# EAGLE design getinline_rev0_unpanaled (EAGLE 7.5.0)
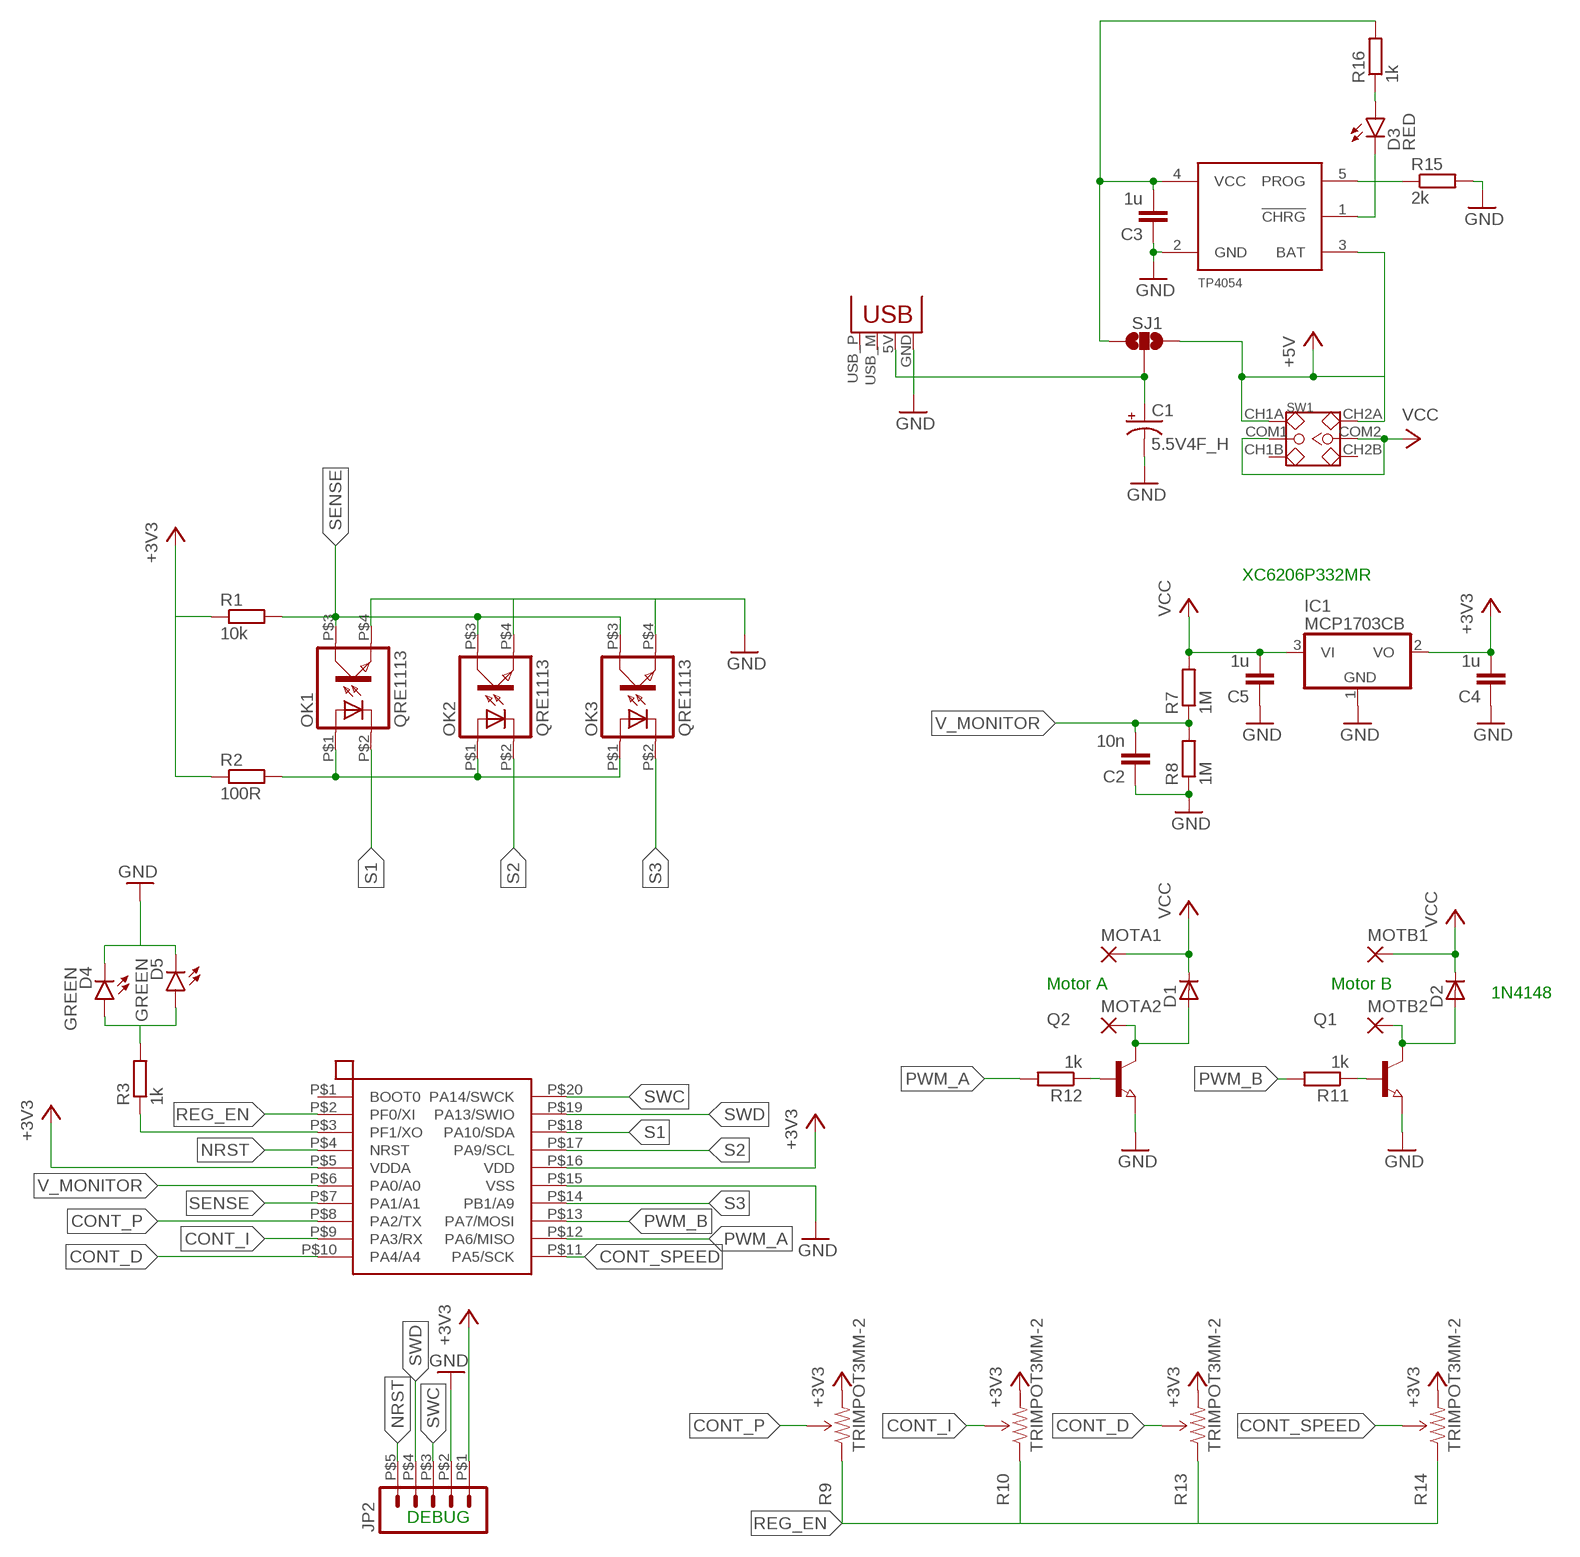
[diagram p0: schematic, sheet 1]

## Parts
C1  5.5V4F_H  [5.5V4F_H]
C2  10n  C-EUC0805  [C0805]
C3  1u  C-EUC0805  [C0805]
C4  1u  C-EUC0805  [C0805]
C5  1u  C-EUC0805  [C0805]
D1  D-SOD-80  [SOD80]
D2  D-SOD-80  [SOD80]
D3  RED  LED-RED1206  [LED-1206]
D4  GREEN  LED-GREENLARGE  [LED-1206]
D5  GREEN  LED-GREENLARGE  [LED-1206]
IC1  MCP1703CB  [SOT23]
JP1  USBPCB  [USB-A-PCB]
JP2  M05  [SMD_HEADER_5P]
MCU  STM32F030F4P6  [TSSOP-20]
MOTA1  1,6/0,9  [1,6/0,9]
MOTA2  1,6/0,9  [1,6/0,9]
MOTB1  1,6/0,9  [1,6/0,9]
MOTB2  1,6/0,9  [1,6/0,9]
OK1  QRE1113  [DIL04]
OK2  QRE1113  [DIL04]
OK3  QRE1113  [DIL04]
Q1  NPN-TRANSISTOR_SOT23  [SOT23]
Q2  NPN-TRANSISTOR_SOT23  [SOT23]
R1  10k  R-EU_R0805  [R0805]
R2  100R  R-EU_R0805  [R0805]
R3  1k  R-EU_R0805  [R0805]
R7  1M  R-EU_R0805  [R0805]
R8  1M  R-EU_R0805  [R0805]
R9  TRIMPOT3MM-2  [TRIMPOT-3MM-2]
R10  TRIMPOT3MM-2  [TRIMPOT-3MM-2]
R11  1k  R-EU_R0805  [R0805]
R12  1k  R-EU_R0805  [R0805]
R13  TRIMPOT3MM-2  [TRIMPOT-3MM-2]
R14  TRIMPOT3MM-2  [TRIMPOT-3MM-2]
R15  2k  R-EU_R0805  [R0805]
R16  1k  R-EU_R0805  [R0805]
SJ1  JUMPER-PAD-3-NOFULL_BOX_SILK  [PAD-JUMPER-3-NO_YES_SILK_FULL_BOX]
SW1  DIP-TOGGLE-SWITCH-2CH-(2X3P-2.54)  [SW6-2.54-9.0X3.5X3.2+2.0MM]
U$1  TP4054_LIPO_CHARGER  [SOT23-5]

## Nets
+3V3: C4.2 IC1.2(VO) JP2.P$1 MCU.P$5(VDDA) MCU.P$16(VDD) R1.1 R2.1 R9.3(CW) R10.3(CW) R13.3(CW) R14.3(CW)
+5V: SJ1.3 SW1.CH1A SW1.CH2A U$1.3(BAT)
CONT_D: MCU.P$10(PA4/A4) R13.2(WIPER)
CONT_I: MCU.P$9(PA3/RX) R10.2(WIPER)
CONT_P: MCU.P$8(PA2/TX) R9.2(WIPER)
CONT_SPEED: MCU.P$11(PA5/SCK) R14.2(WIPER)
GND: C1.P$2(-) C2.1 C3.1 C4.1 C5.1 D4.C D5.C IC1.1(GND) JP1.GND JP2.P$2 MCU.P$15(VSS) OK1.P$4(EMIT) OK2.P$4(EMIT) OK3.P$4(EMIT) Q1.2(E) Q2.2(E) R8.1 R15.2 U$1.2(GND)
LED: MCU.P$3(PF1/XO) R3.1
LEDOUT: D4.A D5.A R3.2
N$1: OK1.P$1(A) OK2.P$1(A) OK3.P$1(A) R2.2
N$3: C3.2 R16.2 SJ1.1 U$1.4(VCC)
N$4: C1.P$1(+) JP1.5V(VBUS) SJ1.2
N$5: R15.1 U$1.5(PROG)
N$6: D3.C U$1.1(!CHRG)
N$7: D3.A R16.1
N$9: Q1.1(B) R11.1
N$10: Q2.1(B) R12.1
N$13: D1.2(A) MOTA2.1(P) Q2.3(C)
N$14: D2.2(A) MOTB2.1(P) Q1.3(C)
NRST: JP2.P$5 MCU.P$4(NRST)
PWM_A: MCU.P$12(PA6/MISO) R12.2
PWM_B: MCU.P$13(PA7/MOSI) R11.2
REG_EN: MCU.P$2(PF0/XI) R9.1(CCW) R10.1(CCW) R13.1(CCW) R14.1(CCW)
S1: MCU.P$18(PA10/SDA) OK1.P$2(C)
S2: MCU.P$17(PA9/SCL) OK2.P$2(C)
S3: MCU.P$14(PB1/A9) OK3.P$2(C)
SENSE: MCU.P$7(PA1/A1) OK1.P$3(COL) OK2.P$3(COL) OK3.P$3(COL) R1.2
SWC: JP2.P$3 MCU.P$20(PA14/SWCK)
SWD: JP2.P$4 MCU.P$19(PA13/SWIO)
V_MONITOR: C2.2 MCU.P$6(PA0/A0) R7.1 R8.2
VCC: C5.2 D1.1(C) D2.1(C) IC1.3(VI) MOTA1.1(P) MOTB1.1(P) R7.2 SW1.COM1 SW1.COM2
Unconnected: JP1.USB_M(D-) JP1.USB_P(D+) MCU.P$1(BOOT0) SW1.CH1B SW1.CH2B

## Notes on the sheet
- XC6206P332MR
- Motor A | Motor B
- 1N4148
- DEBUG

## Library data of the parts
C1 = supercaps:5.5V4F_H
C2-C5 = resistor:C-EU: CAPACITOR, European symbol
D1 D2 = semicon-smd-ipc:D-: DIODE unfilled
D3 = SparkFun-LED:LED-RED: Assorted Red LEDs LilyPad 1206- DIO-09912 1206- DIO-00809 0603- DIO-00819; PROD_ID: DIO-00809
D4 D5 = SparkFun-LED:LED-GREEN: Various green LEDs Green LEDs used in SFE Production 0603- DIO-00821 LARGE- DIO-00862 LILYPAD- DIO-09910; PROD_ID: DIO-00862
IC1 = linear:MCP1703: 250 mA, 16V, Low Quiescent Current LDO Regulator Source: http://ww1.microchip.com/downloads/en/DeviceDoc/22049b.pdf
JP1 = SparkFun-Connectors:USB: USB Connectors USB-B-PTH is fully proven SKU : PRT-00139/CONN-08278 USB-miniB is fully proven SKU : PRT-00587 USB-A-PCB is untested. USB-A-H is throughly reviewed, but untested. Spark Fun Electronics SKU : PRT-00437 USB-B-SMT is throughly reviewed, but untested. Needs silkscreen touching up. USB-A-S has not been used/tested USB-MB-H has not been used/tested USB-MICROB has been used. CONN-09505
JP2 = smd_pinheader:M05: Header 5 Standard 5-pin 0.1" header. Use with straight break away headers (SKU : PRT-00116), right angle break away headers (PRT-00553), swiss pins (PRT-00743), machine pins (PRT-00117), and female headers (PRT-00115). Molex polarized connector foot print use with SKU : PRT-08230 with associated crimp pins and housings.
MCU = pulseoxparts:STM32F030F4P6
MOTA1 MOTA2 MOTB1 MOTB2 = wirepad:1,6/0,9: THROUGH-HOLE PAD
OK1-OK3 = fairchild_optosensor:QRE1113: FAIRCHILD REFLECTIVE SENSOR
Q1 Q2 = semicon-smd-ipc:NPN-TRANSISTOR_: NPN TRANSISTOR
R1-R3 R7 R8 R11 R12 R15 R16 = resistor:R-EU_: RESISTOR, European symbol
R9 R10 R13 R14 = SparkFun-Electromechanical:TRIMPOT: Various small potentiometers for "set-and-forget" applications
SJ1 = SparkFun-Passives:JUMPER-PAD-3-NO
SW1 = Seeed-Switch-2016:DIP-TOGGLE-SWITCH-2CH-(2X3P-2.54): 311010004; MPN: MS-22D18 G2 ROHS
U$1 = TP4054_lipocharger:TP4054_LIPO_CHARGER

## Board
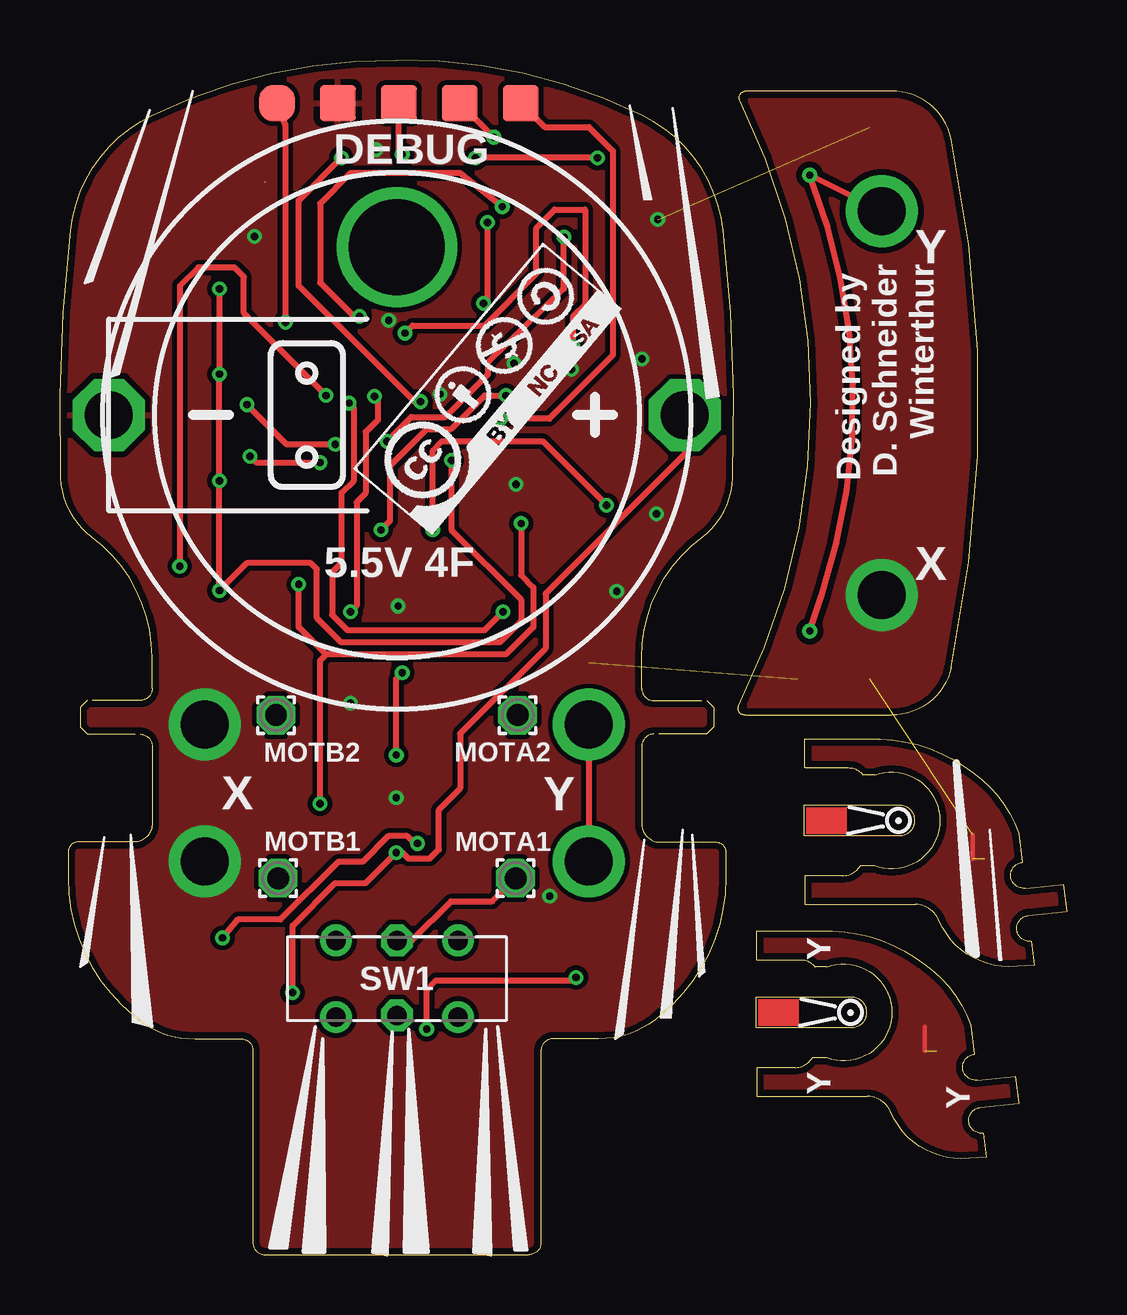
[diagram p1: board, top side]
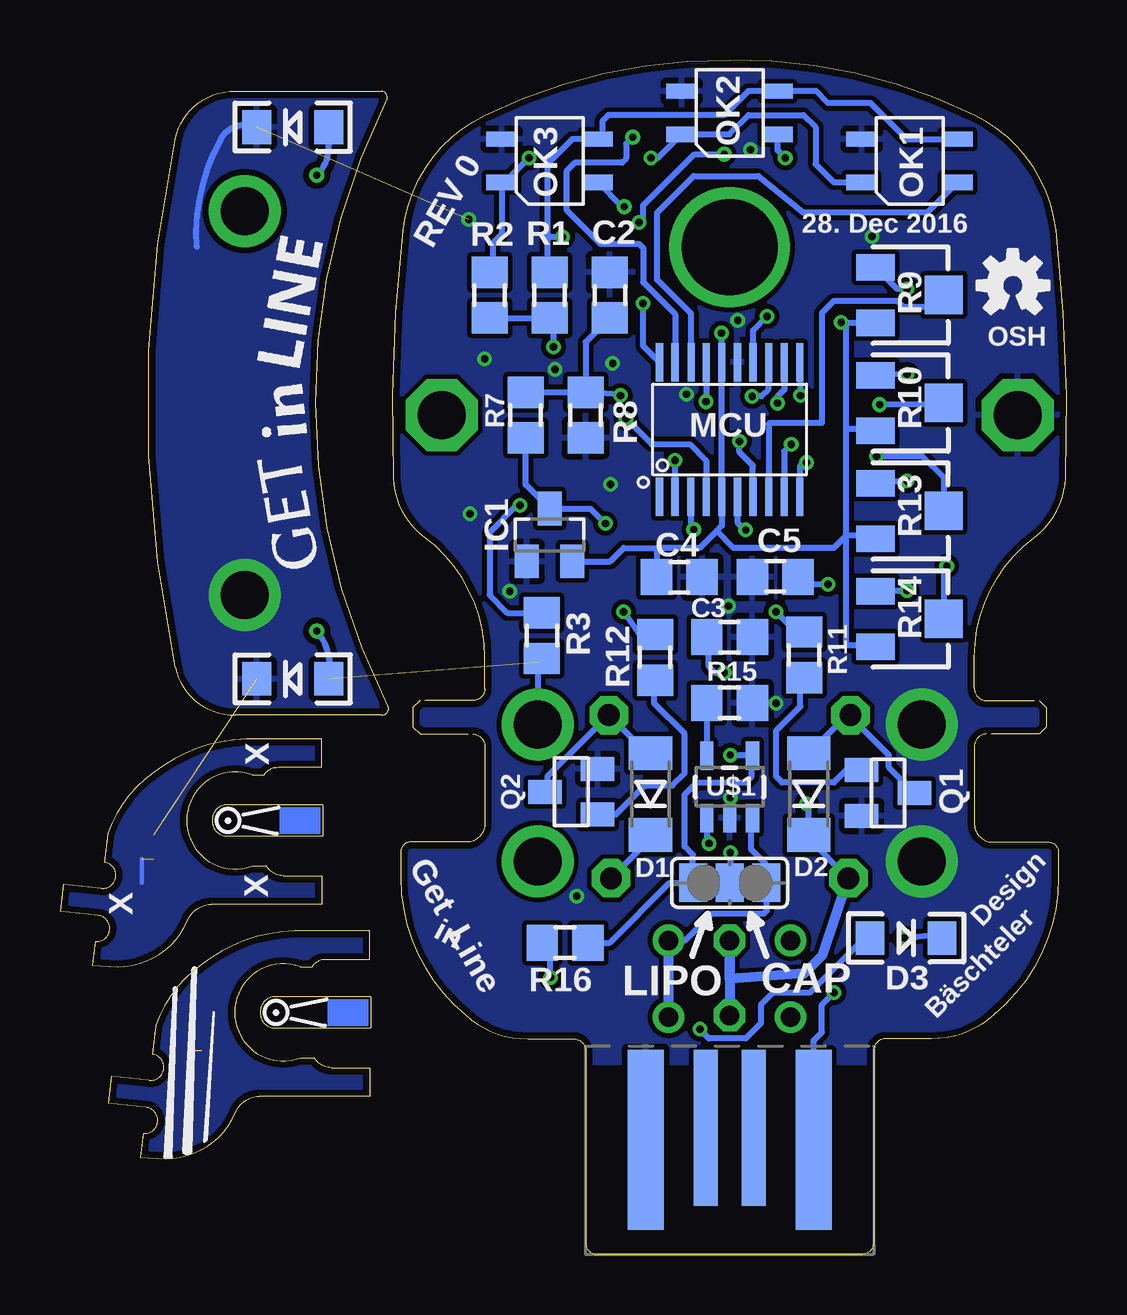
[diagram p2: board, bottom side, seen from below]

Size 41.94 x 49.8 mm. Coordinates in mm from the lower left corner, seen from the top.
Outline: 24.24,23.6 arc90 24.74,23.1 26.94,23.1 27.24,22.8 27.24,22 26.94,21.7 24.74,21.7 arc90 24.24,21.2 24.24,17.92 arc90 25.06,17.2 27.33,17.2 arc-90 27.74,16.79 27.74,15.7 arc-51 25.04,10 arc-44 22.44,9 20.54,9 arc90 20.04,8.5 20.04,0.5 arc-90 19.54,0 8.54,0 arc-90 8.04,0.5 8.04,8.5 arc90 7.54,9 5.64,9 arc-44 3.04,10 arc-51 0.34,15.7 0.34,16.79 arc-90 0.75,17.2 3.02,17.2 arc90 3.84,17.92 3.84,21.2 arc90 3.34,21.7 1.14,21.7 0.84,22 0.84,22.8 1.14,23.1 3.34,23.1 arc90 3.84,23.6 3.84,24.9 arc53 1.34,29.9 arc-51 0.04,32.4 arc-9 0.44,42.7 arc-57 3.84,47.5 arc-27 14.04,49.8 arc-27 24.24,47.5 arc-57 27.64,42.7 arc-9 28.04,32.4 arc-51 26.74,29.9 arc53 24.24,24.9 24.24,23.6
Outline: 28.54,22.5 34.64,22.5 arc79 37.14,24.5 arc24 37.14,46.5 arc79 34.64,48.5 28.54,48.5 arc113 28.34,48.09 arc-53 28.29,22.9 arc127 28.54,22.5
Outline: 31.04,20.3 32.84,20.3 arc-56 33.44,20 33.94,20 arc-220 33.94,16.2 33.34,16.2 arc-56 32.64,15.8 31.04,15.8 31.04,14.6 35.64,14.6 arc-69 36.64,13.9 arc66 39.54,12 40.59,12.06 40.47,13.06 arc-180 40.35,14.14 41.94,14.3 41.8,15.45 40.21,15.28 arc-180 40.09,16.36 39.94,17.56 arc35 38.04,20.1 arc15 36.24,21.1 arc22 33.64,21.5 31.04,21.5 31.04,20.3
Outline: 29.04,12.3 30.84,12.3 arc-56 31.44,12 31.94,12 arc-220 31.94,8.2 31.34,8.2 arc-56 30.64,7.8 29.04,7.8 29.04,6.6 33.64,6.6 arc-69 34.64,5.9 arc66 37.54,4 38.59,4.06 38.47,5.06 arc-180 38.35,6.14 39.94,6.3 39.8,7.45 38.21,7.28 arc-180 38.09,8.36 37.94,9.56 arc35 36.04,12.1 arc15 34.24,13.1 arc22 31.64,13.5 29.04,13.5 29.04,12.3
Outline: 28.99,10.75 28.99,9.45 32.99,9.45 arc90 33.59,10.05 33.59,10.15 arc90 32.99,10.75 28.99,10.75
Outline: 30.99,18.75 30.99,17.45 34.99,17.45 arc90 35.59,18.05 35.59,18.15 arc90 34.99,18.75 30.99,18.75
Copper layers (1*16): Top 0.035mm / dielectric 1.5mm / Bottom 0.035mm
Design rules "dirt_cheap_dirty_boards.v1": minimum track width 5mil, minimum drill 12mil, track to track 5mil, track to pad 5mil, pad to pad 5mil, via to via 5mil, smd to smd 0mil, copper to edge 10mil, drill to drill 10mil, minimum pad ring 10mil, minimum via ring 6mil, stop-mask expansion 2mil, vias tented up to drill 25mil, thermal gap 10mil

### Footprints (pad centres in the part's own frame; a part is rotated, then mirrored left to right if it is on the bottom)
5.5V4F_H = drill 2 octagon: P$1 -12,0; P$2 12,0
C0805 = smd 1.3 x 1.5: 1 -0.95,0; 2 0.95,0
SOD80 = smd 1.4 x 1.8: 1 -1.7,0; 2 1.7,0
LED-1206 = smd 1.2 x 1.4: A -1.5,0; C 1.5,0
SOT23 = smd 1 x 1.4: 1 -0.95,-1.1; 2 0.95,-1.1; 3 0,1.1
USB-A-PCB = smd 7.5 x 1.5: 5V -0.2,-3.5; GND -0.2,3.5 | smd 6.5 x 1: USB_M 0.3,-1; USB_P 0.3,1
SMD_HEADER_5P = smd 1.5 x 1.5: P$1 0,0; P$2 2.54,0; P$3 5.08,0; P$4 7.62,0; P$5 10.16,0
TSSOP-20 = smd 1.6 x 0.3: P$1 -2.8,2.925; P$2 -2.8,2.275; P$3 -2.8,1.625; P$4 -2.8,0.975; P$5 -2.8,0.325; P$6 -2.8,-0.325; P$7 -2.8,-0.975; P$8 -2.8,-1.625; P$9 -2.8,-2.275; P$10 -2.8,-2.925; P$11 2.8,-2.925; P$12 2.8,-2.275; P$13 2.8,-1.625; P$14 2.8,-0.975; P$15 2.8,-0.325; P$16 2.8,0.325; P$17 2.8,0.975; P$18 2.8,1.6; P$19 2.8,2.275; P$20 2.8,2.925
1,6/0,9 = drill 0.914 pad 1.6 octagon: 1 0,0
DIL04 = smd 0.635 x 1.27: P$1 0.3,-2; P$2 0.3,2; P$3 -1.5,2; P$4 -1.5,-2
R0805 = smd 1.3 x 1.5: 1 -0.95,0; 2 0.95,0
TRIMPOT-3MM-2 = smd 1.092 x 1.6: 1 -1.155,-1.421; 3 1.155,-1.421 | smd 1.6 x 1.6: 2 0,1.421
PAD-JUMPER-3-NO_YES_SILK_FULL_BOX = smd 1.168 x 1.6: 1 -1.524,0; 2 0,0; 3 1.524,0
SW6-2.54-9.0X3.5X3.2+2.0MM = drill 0.813 pad 1.27: CH1A -2.54,-1.6; CH1B 2.54,-1.6; CH2A -2.54,1.6; CH2B 2.54,1.6 | drill 0.813 pad 1.27 octagon: COM1 0,-1.6; COM2 0,1.524
SOT23-5 = smd 0.55 x 1.2: 1 -0.95,-1.3; 2 0,-1.3; 3 0.95,-1.3; 4 0.95,1.3; 5 -0.95,1.3

### Placement (x,y rotation side)
C1  14.04,35 180 top
C2  19.04,40 270 bottom
C3  14.04,25.75 180 bottom
C4  16.14,28.25 180 bottom
C5  12.14,28.25 0 bottom
D1  17.34,19.2 90 bottom
D2  10.74,19.2 90 bottom
D3  6.68,13.2 0 bottom
D4  32.24,47 180 bottom
D5  32.24,24 180 bottom
IC1  21.54,30 0 bottom
JP1  14.04,5 90 bottom
JP2  9.04,48 0 top
MCU  14.04,34.4 90 bottom
MOTA1  18.98,15.69 0 top
MOTA2  19.07,22.49 0 top
MOTB1  9.09,15.69 0 top
MOTB2  9,22.49 0 top
OK1  6.54,45 270 bottom
OK2  14.04,47 270 bottom
OK3  21.54,45 270 bottom
Q1  7.44,19.25 270 bottom
Q2  20.64,19.3 90 bottom
R1  21.54,40 90 bottom
R2  24.04,40 90 bottom
R3  21.86,25.81 270 bottom
R7  22.54,35 270 bottom
R8  20.04,35 90 bottom
R9  6.54,40 270 bottom
R10  6.54,35.5 270 bottom
R11  10.94,25 90 bottom
R12  17.14,24.9 90 bottom
R13  6.54,31 270 bottom
R14  6.54,26.5 270 bottom
R15  14.04,23 0 bottom
R16  20.89,13 0 bottom
SJ1  14.04,15.5 0 bottom
SW1  14.04,11.5 180 top
U$1  14.04,19.5 0 bottom
U$2  [OSHW-LOGO-S]  2.24,40.4 0 bottom
U$3  [CC-BY-NC-SA]  15.5,30.03 50 top

### Tracks (layer width: path | path; a pad name or v marks a point on that pad's centre or on a via)
+3V3  (via drill 0.3)
  Top 0.254: v14.37,38.41 14.69,38.73 17.69,38.73 19.85,40.89 19.85,42.8 20.61,43.56 21.88,43.56 21.88,39.62 21.37,39.12 v21.37,37.85 | JP2.P$1 9.38,47.09 v9.39,38.87
  Bottom 0.254: R2.1 R1.1 21.37,38.99 v21.37,37.85 | v14.37,38.41 14.36,38.2 MCU.P$16 MCU.P$5 14.36,30.39 14.58,30.17 | C4.2 17.06,28.03 17.06,29.46 | R13.3 8.09,29.97 9.18,29.97 | 9.18,29.97 9.18,34.42 | 9.18,34.42 9.18,38.86 | 9.18,38.86 9.17,38.84 R9.3 | R10.3 8.03,34.42 9.18,34.42 | R14.3 8.01,25.4 9.18,25.4 9.18,29.97 | 14.58,30.17 15.28,29.46 17.06,29.46 | 9.18,29.97 9.69,29.46 13.88,29.46 14.58,30.17 | IC1.2 19.02,28.9 18.45,29.46 17.06,29.46 | v9.39,38.87 v9.39,38.86 9.18,38.86
+5V
  Bottom 0.254: U$1.3 13.14,17.85 13.14,16.9 12.51,16.28 SJ1.3 12.48,15.47 12.48,14.35 12.61,14.22 14.77,14.22 15.89,13.1 SW1.CH1A
  Bottom 0.406: SW1.CH2A SW1.CH1A
CONT_D  (via drill 0.3)
  Top 0.254: v7.91,33.27 8.17,33.02 v10.83,33.02
  Bottom 0.254: MCU.P$10 11.09,31.63 11.09,32.89 10.96,33.02 v10.83,33.02 | R13.2 5.12,32.38 6.01,33.27 v7.91,33.27
CONT_I  (via drill 0.3)
  Top 0.254: v7.79,35.43 9.44,33.78 v11.47,33.78
  Bottom 0.254: R10.2 5.18,35.43 v7.79,35.43 | v11.47,33.78 11.76,33.49 MCU.P$9
CONT_P
  Bottom 0.254: R9.2 5.62,39.5 6.77,39.5 7.02,39.75 9.69,39.75 10.2,39.24 10.2,34.67 12.36,34.67 12.41,34.62 MCU.P$8
CONT_SPEED  (via drill 0.3)
  Top 0.254: v11.09,35.81 7.66,39.24 7.66,40.77 7.28,41.15 5.75,41.15 4.99,40.39 v4.99,28.7
  Bottom 0.254: MCU.P$11 11.09,37.17 v11.09,35.81 | v4.99,28.7 5.12,28.58 R14.2
GND  (via drill 0.3, 2)  (3 unrouted)
  Top 0.178: 38.04,17.5 38.04,16.5
  Top 0.254: v14.01,19.05 14.01,18.92
  Bottom 0.178: 38.54,15.5 38.54,16.5
  Bottom 0.254: U$1.2 14.04,19.02 v14.01,19.05 | 36.24,42 arc32 35.24,46.5 arc86 D4.C
  other vias: 13.7,38.95 12.1,22.99 6.04,22.1 6.04,16.4 20.41,14.95 24.91,43.15 8.11,42.45 34.24,27.5 18.91,37.16 24.24,37.34 21.32,36.91 19,32.11 23.2,27.66 24.85,30.89 14.09,27.04 13.17,46.06 15.83,35.87
  pour Bottom (isolate 0.2): 0.04,50 0.04,8 28.04,8 28.04,50
  pour Top (isolate 0.2): 0.04,50 0.04,0 28.04,0 28.04,50
  pour Bottom (isolate 0.254): 28.24,22.5 34.74,22.5 arc77 37.24,24.5 arc25 37.24,46.5 arc77 34.74,48.5 28.24,48.5 arc-49
  pour Top: 31.04,21.5 42.54,21.5 41.57,11.89 29.04,13
  pour Bottom: 31.04,21.5 42.14,21.5 41.57,11.89 29.04,13
  pour Top (isolate 0.254): 28.14,48.5 34.64,48.5 arc-77 37.14,46.5 arc-25 37.14,24.5 arc-77 34.64,22.5 28.14,22.5 arc50
GND1  (1 unrouted)
  Top 0.178: 36.04,9.5 36.04,8.5
  Bottom 0.178: 36.54,7.5 36.54,8.5
  pour Top: 29.04,13.5 42.54,12.5 39.57,3.89 29.04,4
  pour Bottom: 29.04,13.5 42.14,12.5 39.57,3.89 29.04,4
LED  (via drill 0.3)
  Top 0.254: v15.53,30.23 15.53,33.53 15.91,33.91 20.1,33.91 v22.77,31.24
  Bottom 0.254: MCU.P$3 15.66,30.36 v15.53,30.23 | v22.77,31.24 22.9,31.24 24.04,30.1 24.04,27.5 23.3,26.76 R3.1
LEDOUT  (via drill 0.3, 2)  (1 unrouted)
  Top 0.254: v31.24,26 31.74,27.5 arc40 v31.24,45 v34.24,43.5 | v22.04,22.1 v22.04,16.4
  Bottom 0.254: v31.24,45 arc-74 30.92,46.96 arc21 D4.A | D5.A arc-53 v31.24,26 | R3.2 22.04,24.68 v22.04,22.1
N$1  (via drill 0.3)  (1 unrouted)
  Top 0.254: v22.39,45.72 v17.31,45.72
  Bottom 0.254: v22.39,45.72 23.41,44.7 OK3.P$1 23.54,42.54 23.91,42.16 23.91,40.97 R2.2 | v17.31,45.72 17.02,45.72 OK2.P$1 14.04,46.7 13.25,47.5 10.96,47.5 10.45,46.99 10.45,45.47 9.69,44.7 OK1.P$1
N$3  (via drill 0.3)
  Top 0.254: v14.01,20.83 14.01,24 v14.26,24.26
  Bottom 0.254: R16.2 19.04,13 16.55,15.49 SJ1.1 | SJ1.1 | SJ1.1 15.57,16.67 15.91,17.02 15.91,19.18 15.41,19.68 13.37,19.68 13.12,19.94 13.12,20.77 U$1.4 13.98,20.8 v14.01,20.83 | v14.26,24.26 14.64,24.26 14.9,24.51 14.9,25.41 C3.2
N$4  (via drill 0.3)
  Top 0.254: v9.69,10.92 9.69,13.72 11.47,15.49 12.74,15.49 v14.01,16.76 14.26,16.76 14.52,16.51 15.41,16.51 15.79,16.89 15.79,18.54 16.68,19.43 16.68,21.72 20.23,25.27 20.23,27.56 26.04,33.37 C1.P$1
  Bottom 0.254: JP1.5V 10.54,8.93 10.2,9.27 10.2,10.41 v9.69,10.92 | v14.01,16.76 14.01,15.53 SJ1.2
N$5
  Bottom 0.254: R15.1 14.99,22.9 U$1.5
N$6  (via drill 0.3)
  Top 0.254: v14.9,17.14 14.77,17.14 14.46,17.45 13.68,17.45 12.61,16.38 11.6,16.38 9.18,13.97 7.4,13.97 v6.77,13.21
  Bottom 0.254: U$1.1 14.99,17.24 v14.9,17.14 | v6.77,13.21 5.57,13.34 D3.C
N$7  (via drill 0.3)
  Top 0.254: v15.28,9.4 15.28,11.05 15.66,11.43 21.37,11.43 v21.5,11.56
  Bottom 0.254: D3.A 8.44,13.19 10.71,10.92 12.23,10.92 12.74,10.41 12.74,9.65 13.37,9.02 14.9,9.02 v15.28,9.4 | v21.5,11.56 21.5,12.99 R16.1
N$8  (via drill 4)
  other vias: 14.04,42
N$9
  Bottom 0.254: Q1.1 9.18,20.2 9.69,19.68 11.85,19.68 12.1,19.94 12.1,21.84 11.09,22.86 11.09,24 R11.1
N$10
  Bottom 0.254: Q2.1 18.77,18.35 17.56,19.56 16.42,19.56 15.91,20.07 15.91,21.72 17.18,22.99 17.18,24 R12.1
N$13
  Bottom 0.254: Q2.3 21.63,19.41 21.63,19.94 MOTA2.1 17.48,20.9 D1.2
N$14
  Bottom 0.254: Q1.3 7.4,20.32 7.4,20.83 9,22.42 MOTB2.1 9.14,22.49 D2.2
NRST  (via drill 0.3)
  Top 0.254: JP2.P$5 20.2,47 22.04,47 23.04,46 23.04,37.5 20.39,34.85 v18.35,34.85
  Bottom 0.254: v18.35,34.85 17.29,33.78 15.68,33.78 15.01,33.11 MCU.P$4
PWM_A  (via drill 0.3)
  Top 0.254: v12.05,35.5 12.23,35.32 12.23,32.26 11.72,31.75 11.72,28.83 11.34,28.45 11.34,26.67 11.98,26.04 17.69,26.04 v18.45,26.8
  Bottom 0.254: MCU.P$12 11.76,36.06 12.05,35.77 v12.05,35.5 | v18.45,26.8 17.72,25.75 R12.2
PWM_B  (via drill 0.3)
  Top 0.254: v13.1,35.78 13.25,35.63 13.25,34.8 12.74,34.29 12.74,31.75 12.36,31.37 12.36,27.05 v12.1,26.8
  Bottom 0.254: MCU.P$13 12.44,37.17 12.44,36.06 12.72,35.78 v13.1,35.78 | v12.1,26.8 11.16,25.85 R11.2
REG_EN  (via drill 0.3)
  Top 0.254: v6.64,40.26 v6.64,36.7 v6.64,32.26 v6.64,27.69 7.79,28.83 10.45,28.83 10.71,28.57 10.71,26.54 11.72,25.53 18.33,25.53 19.22,26.42 19.22,27.3 16.31,30.21 v16.31,33.11
  Bottom 0.254: R9.1 7.06,40.26 v6.64,40.26 | v6.64,36.7 7.86,36.66 R10.1 | R13.1 7.86,32.26 v6.64,32.26 | R14.1 7.93,27.69 v6.64,27.69 | MCU.P$2 v16.31,33.11
S1
  Bottom 0.254: MCU.P$18 15.64,39.22 17.06,40.64 17.06,43.43 15.53,44.96 12.84,44.96 10.96,43.43 5.8,43.43 OK1.P$2
S2  (via drill 0.3)
  Top 0.254: v15.02,35.56 14.77,35.56 9.94,40.39 9.94,43.94 v11.72,45.72
  Bottom 0.254: MCU.P$17 15.01,35.57 v15.02,35.56 | v11.72,45.72 12.04,46.04 OK2.P$2
S3  (via drill 0.3)
  Top 0.254: v18.43,43.69 16.68,45.09 12.1,45.09 10.83,43.81 10.83,40.51 12.23,39.12 v12.48,39.12
  Bottom 0.254: MCU.P$14 13.06,38.54 v12.48,39.12 | v18.43,43.69 18.53,43.69 OK3.P$2
SENSE  (via drill 0.3)
  Top 0.254: v13.63,33.91 14.64,34.92 16.06,34.92 17.84,36.7 17.84,37.2 20.99,40.26 v20.99,42.42
  Bottom 0.254: 12.02,48.51 OK2.P$3 | OK2.P$3 13.26,48.5 14.26,47.5 19.09,47.5 19.34,47.24 19.34,46.7 OK3.P$3 20.59,46.5 21.63,45.47 21.63,42.42 | 21.63,42.42 21.63,40.94 R1.2 | MCU.P$7 13.07,32.89 13.63,33.45 v13.63,33.91 | v20.99,42.42 21.63,42.42 | OK1.P$3 4.56,46.48 6.64,46.48 8.17,48.01 9.94,48.01 10.44,48.5 OK2.P$3
SWC  (via drill 0.3)
  Top 0.254: v17.64,39.65 17.82,39.83 v17.82,43.03 | v14.26,45.87 14.12,46.02 JP2.P$3
  Bottom 0.254: MCU.P$20 17.64,37.88 v17.64,39.65 | v17.82,43.03 17.64,43.2 17.64,43.74 15.51,45.87 v14.26,45.87
SWD  (via drill 0.3)
  Top 0.254: JP2.P$4 v18.07,46.58
  Bottom 0.254: v18.07,46.58 18.35,46.31 18.35,45.7 18.53,45.52 20.49,45.52 20.84,45.16 20.84,43.56 19.42,42.14 17.82,42.14 17.64,41.96 17.64,40.54 16.31,39.21 MCU.P$19
V_MONITOR  (via drill 0.3)
  Top 0.254: v13.37,30.21 13.75,30.6 13.75,32.89 15.28,34.42 16.29,34.42 17.69,35.81 v18.58,35.81
  Bottom 0.254: C2.2 20.04,38.05 R8.2 | R7.1 R8.2 | MCU.P$6 13.72,30.52 13.41,30.21 v13.37,30.21 | v18.58,35.81 18.62,35.85 R8.2
VCC  (via drill 0.3)
  Top 0.254: SW1.COM1 14.66,13.1 16.29,14.73 18.02,14.73 MOTA1.1 | v19.22,30.48 19.22,28.32 19.72,27.81 19.72,26.16 18.58,25.02 11.09,25.02 | 11.09,25.02 9.94,26.16 v9.94,27.94 | v10.83,18.8 10.83,24.77 11.09,25.02
  Bottom 0.254: R7.2 22.54,32.1 IC1.3 19.84,31.1 v19.22,30.48 | MOTB1.1 10.74,17.34 D2.1 10.74,18.7 v10.83,18.8 | D1.1 17.34,17.34 MOTA1.1 | v9.94,27.94 11.13,27.94 C5.2
  Bottom 0.406: MOTB1.1 10.18,12.47 10.93,11.72 14.04,11.5 SW1.COM1 SW1.COM2
(copper drawn outside any net)
  shapes: Bottom area x2, Top area x2

### Text on the board
tNames: DEBUG | Designed by / D. Schneider / Winterthur | Y | X | X | Y | Y | Y | Y
bNames: 28. Dec 2016 | REV 0 | OSH | X | Get Line | X | X | Design | in | CAP | LIPO | Bäschteler